# EAGLE design buttons (EAGLE 9.6.2)
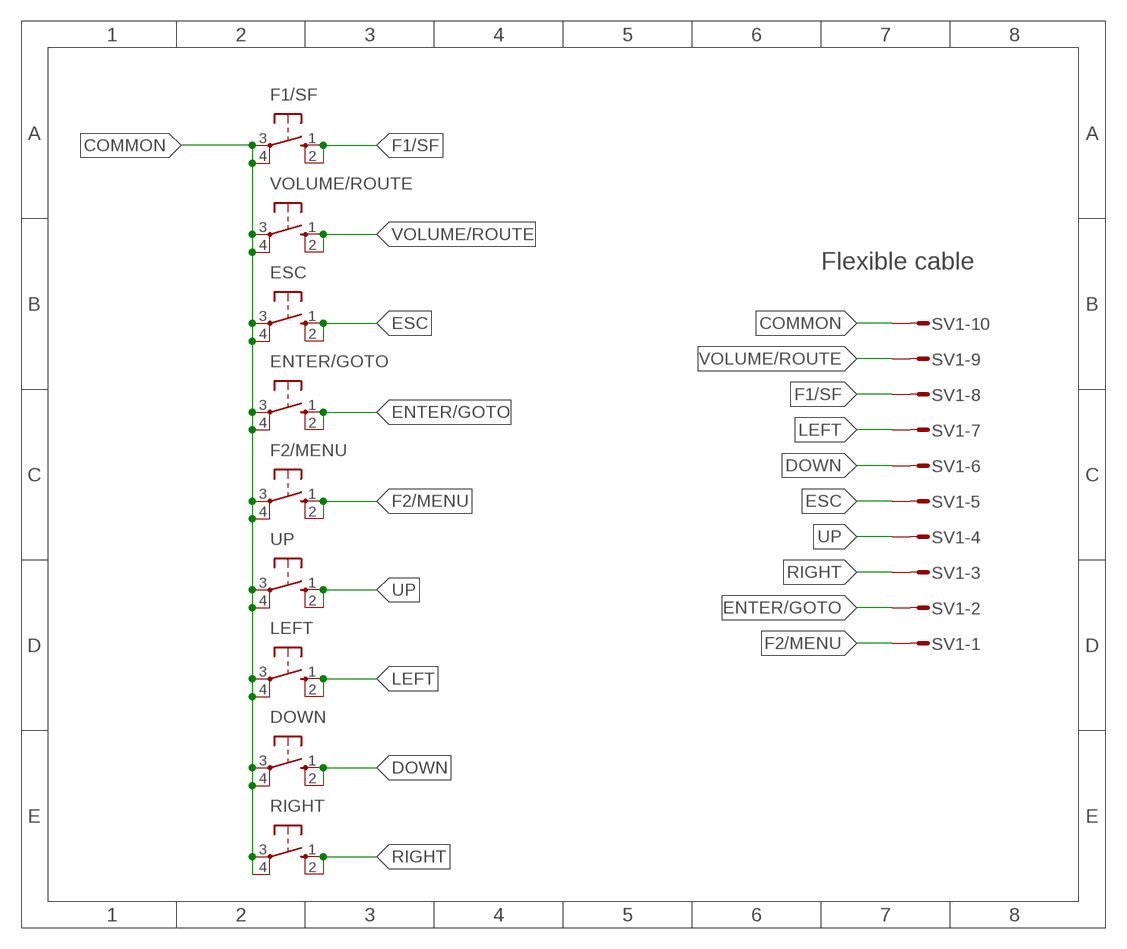
[diagram p0: schematic, sheet 1]

## Parts
DOWN  10-XX  [B3F-10XX]
ENTER/GOTO  10-XX  [B3F-10XX]
ESC  10-XX  [B3F-10XX]
F1/SF  10-XX  [B3F-10XX]
F2/MENU  10-XX  [B3F-10XX]
LEFT  10-XX  [B3F-10XX]
RIGHT  10-XX  [B3F-10XX]
SV1  S10P  [S10P]
UP  10-XX  [B3F-10XX]
VOLUME/ROUTE  10-XX  [B3F-10XX]

## Nets
COMMON: DOWN.3(P) DOWN.4(P1) ENTER/GOTO.3(P) ENTER/GOTO.4(P1) ESC.3(P) ESC.4(P1) F1/SF.3(P) F1/SF.4(P1) F2/MENU.3(P) F2/MENU.4(P1) LEFT.3(P) LEFT.4(P1) RIGHT.3(P) RIGHT.4(P1) SV1.10 UP.3(P) UP.4(P1) VOLUME/ROUTE.3(P) VOLUME/ROUTE.4(P1)
DOWN: DOWN.1(S) DOWN.2(S1) SV1.6
ENTER/GOTO: ENTER/GOTO.1(S) ENTER/GOTO.2(S1) SV1.2
ESC: ESC.1(S) ESC.2(S1) SV1.5
F1/SF: F1/SF.1(S) F1/SF.2(S1) SV1.8
F2/MENU: F2/MENU.1(S) F2/MENU.2(S1) SV1.1
LEFT: LEFT.1(S) LEFT.2(S1) SV1.7
RIGHT: RIGHT.1(S) RIGHT.2(S1) SV1.3
UP: SV1.4 UP.1(S) UP.2(S1)
VOLUME/ROUTE: SV1.9 VOLUME/ROUTE.1(S) VOLUME/ROUTE.2(S1)

## Notes on the sheet
- Flexible cable

## Library data of the parts
DOWN ENTER/GOTO ESC F1/SF F2/MENU LEFT RIGHT UP VOLUME/ROUTE = switch-omron:10-XX: OMRON SWITCH; MPN: B3F-1000; OC_FARNELL: 176432; OC_NEWARK: 36M3542
SV1 = con-amp-mt:S10P: AMP MT CONNECTOR; OC_FARNELL: unknown; OC_NEWARK: unknown

## Board
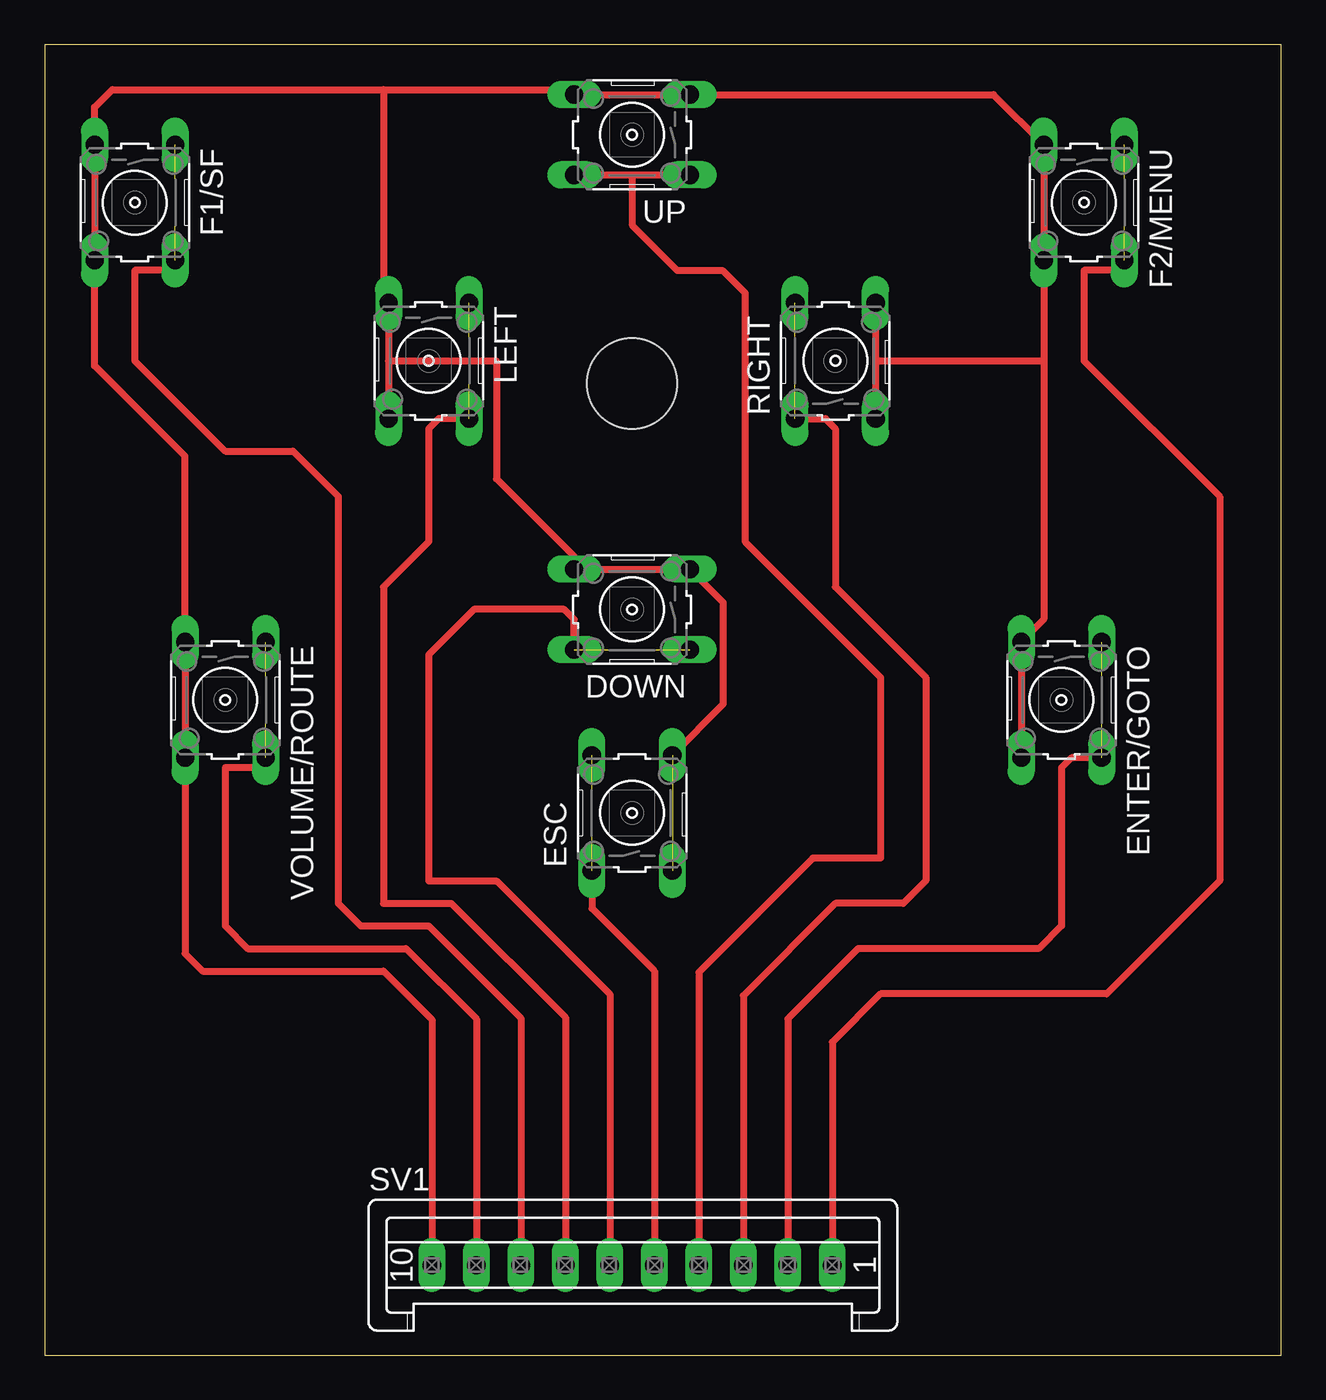
[diagram p1: board, top side]

Size 69.52 x 73.65 mm. Coordinates in mm from the lower left corner, seen from the top.
Outline: 0,0 69.52,0 69.52,73.65 0,73.65 0,0
Copper layers (1*16): Top 0.035mm / dielectric 1.5mm / Bottom 0.035mm
Design rules "default": minimum track width 6mil, minimum drill 0.35mm, track to track 6mil, track to pad 6mil, pad to pad 6mil, via to via 6mil, smd to smd 6mil, copper to edge 40mil, drill to drill 6mil, minimum pad ring 10mil, minimum via ring 8mil, stop-mask expansion 4mil, vias tented up to drill 0mil, thermal gap 10mil
Holes 5.08 mm at 33.02,54.61

### Footprints (pad centres in the part's own frame; a part is rotated, then mirrored left to right if it is on the bottom)
B3F-10XX = drill 1.016 long: 1 -3.251,2.261; 2 3.251,2.261; 3 -3.251,-2.261; 4 3.251,-2.261
S10P = drill 1.016 long: 1 11.25,0; 2 8.75,0; 3 6.25,0; 4 3.75,0; 5 1.25,0; 6 -1.25,0; 7 -3.75,0; 8 -6.25,0; 9 -8.75,0; 10 -11.25,0

### Placement (x,y rotation side)
DOWN  33.02,41.91 180 top
ENTER/GOTO  57.15,36.83 270 top
ESC  33.02,30.48 90 top
F1/SF  5.08,64.77 270 top
F2/MENU  58.42,64.77 270 top
LEFT  21.59,55.88 270 top
RIGHT  44.45,55.88 90 top
SV1  33.02,5.08 0 top
UP  33.02,68.58 180 top
VOLUME/ROUTE  10.16,36.83 270 top

### Tracks (layer width: path | path; a pad name or v marks a point on that pad's centre or on a via)
COMMON  (1 unrouted)
  Top 0.406: 19.05,71.12 3.81,71.12 2.82,70.13 F1/SF.3 F1/SF.4 2.82,55.6 7.9,50.52 VOLUME/ROUTE.3 VOLUME/ROUTE.4 7.9,22.58 8.89,21.59 19.05,21.59 21.77,18.87 SV1.10 | 19.05,71.12 29.49,71.12 UP.4 UP.3 53.34,70.84 F2/MENU.3 F2/MENU.4 56.16,55.88 | 56.16,55.88 56.16,41.35 ENTER/GOTO.3 ENTER/GOTO.4 | RIGHT.4 46.71,55.88 | 46.71,55.88 RIGHT.3 | 46.71,55.88 56.16,55.88 | 19.05,71.12 19.05,59.41 LEFT.3 19.33,55.88 | 19.33,55.88 LEFT.4 | DOWN.4 30.48,44.17 | 30.48,44.17 DOWN.3 38.15,42.29 38.15,36.6 ESC.4 | 19.33,55.88 25.4,55.88 25.4,49.25 30.48,44.17
DOWN  (1 unrouted)
  Top 0.406: DOWN.2 29.77,41.35 29.21,41.91 24.13,41.91 21.59,39.37 21.59,26.67 25.4,26.67 31.77,20.3 SV1.6
ENTER/GOTO  (1 unrouted)
  Top 0.406: ENTER/GOTO.2 57.71,33.58 57.15,33.02 57.15,24.13 55.88,22.86 45.72,22.86 41.77,18.91 SV1.2
ESC  (1 unrouted)
  Top 0.406: SV1.5 34.27,21.61 30.76,25.12 ESC.1
F1/SF  (1 unrouted)
  Top 0.406: F1/SF.2 6.78,60.96 5.08,60.96 5.08,55.88 10.16,50.8 13.97,50.8 16.51,48.26 16.51,25.4 17.78,24.13 21.59,24.13 26.77,18.95 SV1.8
F2/MENU  (1 unrouted)
  Top 0.406: F2/MENU.2 60.12,60.96 58.42,60.96 58.42,55.88 66.04,48.26 66.04,26.67 59.69,20.32 46.99,20.32 44.27,17.6 SV1.1
LEFT  (1 unrouted)
  Top 0.406: LEFT.2 22.15,52.63 21.59,52.07 21.59,45.72 19.05,43.18 19.05,25.4 22.86,25.4 29.27,18.99 SV1.7
RIGHT  (1 unrouted)
  Top 0.406: RIGHT.1 43.89,52.63 44.45,52.07 44.45,43.18 49.53,38.1 49.53,26.67 48.26,25.4 44.45,25.4 39.27,20.22 SV1.3
UP
  Top 0.406: UP.2 33.02,66.32 | 33.02,66.32 UP.1 | 33.02,66.32 33.02,63.5 35.56,60.96 38.1,60.96 39.37,59.69 39.37,45.72 46.99,38.1 46.99,27.94 43.18,27.94 36.77,21.53 SV1.4
VOLUME/ROUTE  (1 unrouted)
  Top 0.406: VOLUME/ROUTE.2 11.86,33.02 10.16,33.02 10.16,24.13 11.43,22.86 20.32,22.86 24.27,18.91 SV1.9